# Altium project FreidoraAireCuki.PrjPCB
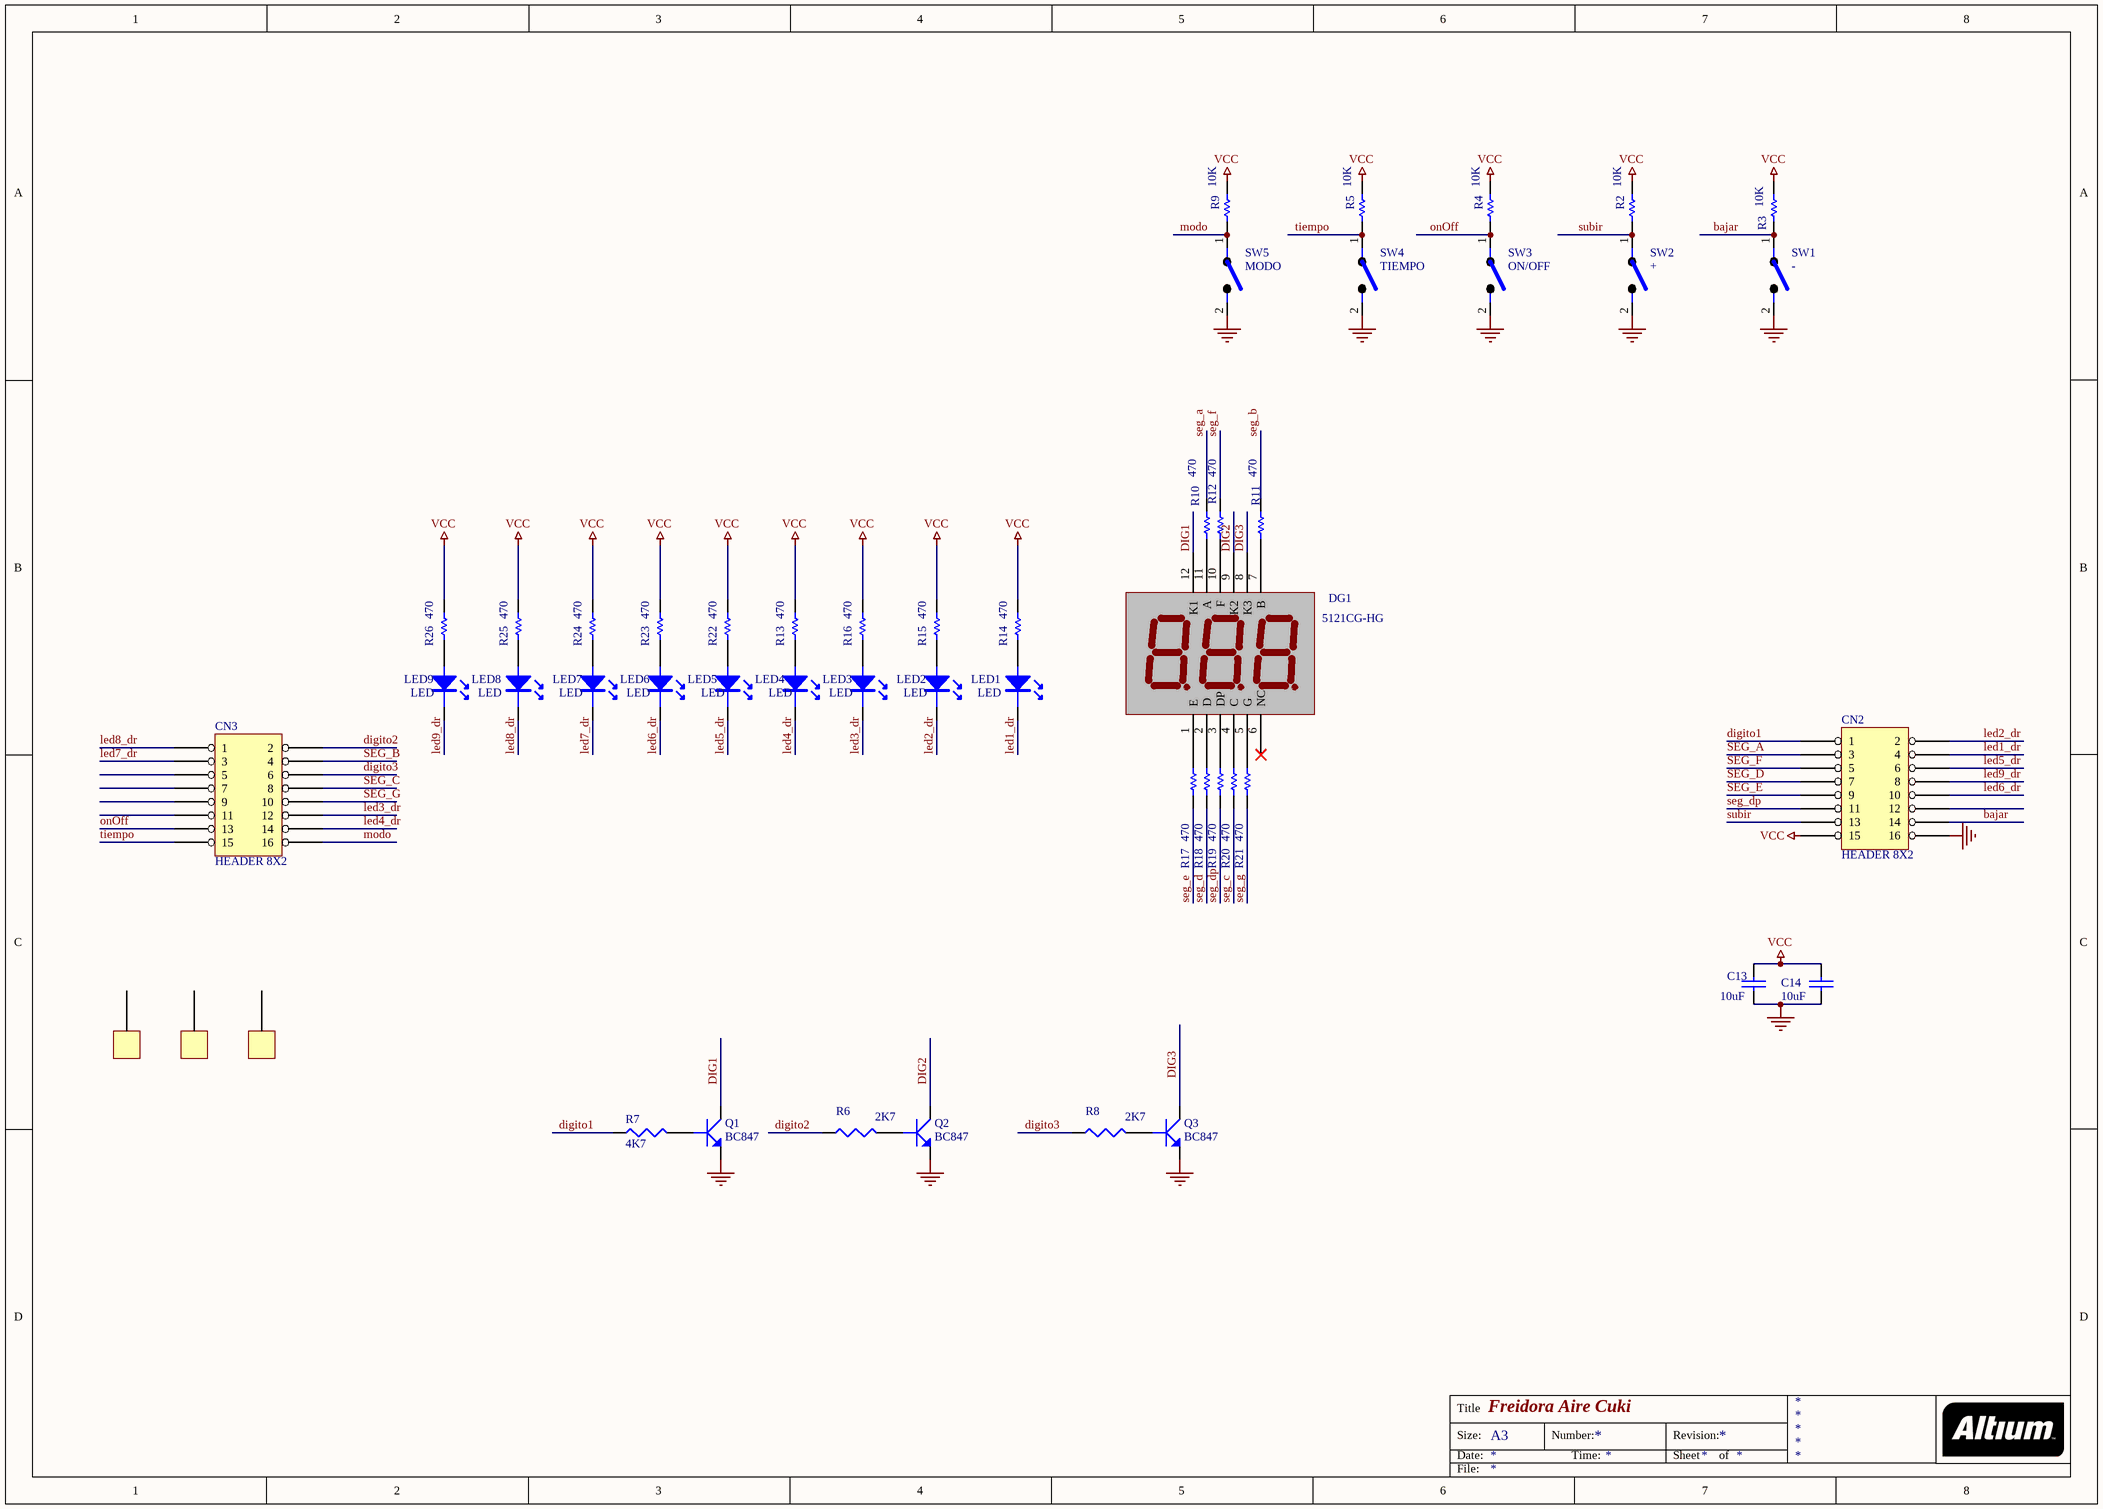
[diagram p0: FreidoraAireCukiDigLeds.SchDoc]
2 sheets, 115 parts. Net scope: global (net labels, ports and power ports of the same name join across sheets).
Board files: FreidoraAireCuki_Mechanical.PcbDoc, FreidoraAireCukiMicro.PcbDoc, FreidoraAireCukiDigLeds.PcbDoc, FreidoraAireCuki_Panel.PcbDoc, FreidoraAireCukiDigLeds_mirrored.PcbDoc, FreidoraAireCukiMicro_mirrored.PcbDoc
Sheets:
  FreidoraAireCukiDigLeds.SchDoc
  FreidoraAireCukiMicro.SchDoc

## Sheet FreidoraAireCukiDigLeds.SchDoc: Freidora Aire Cuki
size A3; Author: Marianito; CompanyName: Marianito INC; DrawnBy: Marianito; Engineer: Marianito; PageSetup: Record=PageOptions|CenterHorizontal=True|CenterVertical=True|PrintScale=0.73|XCorrection=1.00|YCorrection=1.00|PrintKind=0|BorderSize=5000000|LeftOffset=0|BottomOffset=0|Orientation=2|PaperLength=1000|PaperWidth=1000|Scale=100|PaperSource=7|PrintQuality=-4|MediaType=1|DitherType=10|PrintScaleMode=1|PaperKind=A4; ProjectName: Freidora Aire Cuki

### Parts
C13  10uF  [C-0805_N]
C14  10uF  [C-0805_N]
CN2  HEADER 8X2  [SIP2X8]
CN3  HEADER 8X2  [SIP2X8]
DG1  5121CG-HG  [DIGIT_3_400]
LED1  LED  [LED3MM]
LED2  LED  [LED3MM]
LED3  LED  [LED3MM]
LED4  LED  [LED3MM]
LED5  LED  [LED3MM]
LED6  LED  [LED3MM]
LED7  LED  [LED3MM]
LED8  LED  [LED3MM]
LED9  LED  [LED3MM]
Q1  BC847  [SOT23_BOTTOM]
Q2  BC847  [SOT23_BOTTOM]
Q3  BC847  [SOT23_BOTTOM]
R2  10K  [0805BOTTOM]
R3  10K  [0805BOTTOM]
R4  10K  [0805BOTTOM]
R5  10K  [0805BOTTOM]
R6  2K7  [R-0805_N_WAVE]
R7  4K7  [R-0805_N_WAVE]
R8  2K7  [R-0805_N_WAVE]
R9  10K  [0805BOTTOM]
R10  470  [0805BOTTOM]
R11  470  [0805BOTTOM]
R12  470  [0805BOTTOM]
R13  470  [0805BOTTOM]
R14  470  [0805BOTTOM]
R15  470  [0805BOTTOM]
R16  470  [0805BOTTOM]
R17  470  [0805BOTTOM]
R18  470  [0805BOTTOM]
R19  470  [0805BOTTOM]
R20  470  [0805BOTTOM]
R21  470  [0805BOTTOM]
R22  470  [0805BOTTOM]
R23  470  [0805BOTTOM]
R24  470  [0805BOTTOM]
R25  470  [0805BOTTOM]
R26  470  [0805BOTTOM]
SW1  -  [ZIPPY-TS]
SW2  +  [ZIPPY-TS]
SW3  ON/OFF  [ZIPPY-TS]
SW4  TIEMPO  [ZIPPY-TS]
SW5  MODO  [ZIPPY-TS]
TORR1  (no value)  [TORRETA]
TORR2  (no value)  [TORRETA]
TORR3  (no value)  [TORRETA]

### Nets
GND: C13.1 C14.1 CN2.16 Q1.2(E) Q2.2(E) Q3.2(E) SW1.2 SW2.2 SW3.2 SW4.2 SW5.2
VCC: C13.2 C14.2 CN2.15 R2.2 R3.2 R4.2 R5.2 R9.2 R13.2 R14.2 R15.2 R16.2 R22.2 R23.2 R24.2 R25.2 R26.2
bajar: CN2.14 R3.1 SW1.1
DIG1: DG1.12(K1) Q1.3(C)
DIG2: DG1.9(K2) Q2.3(C)
DIG3: DG1.8(K3) Q3.3(C)
digito1: CN2.1 R7.1
digito2: CN3.2 R6.1
digito3: CN3.6 R8.1
led1_dr: CN2.4 LED1.2(K)
led2_dr: CN2.2 LED2.2(K)
led3_dr: CN3.12 LED3.2(K)
led4_dr: CN3.14 LED4.2(K)
led5_dr: CN2.6 LED5.2(K)
led6_dr: CN2.10 LED6.2(K)
led7_dr: CN3.3 LED7.2(K)
led8_dr: CN3.1 LED8.2(K)
led9_dr: CN2.8 LED9.2(K)
modo: CN3.16 R9.1 SW5.1
onOff: CN3.13 R4.1 SW3.1
seg_a: CN2.3 R10.2
seg_b: CN3.4 R11.2
seg_c: CN3.8 R20.1
seg_d: CN2.7 R18.1
seg_dp: CN2.11 R19.1
seg_e: CN2.9 R17.1
seg_f: CN2.5 R12.2
seg_g: CN3.10 R21.1
subir: CN2.13 R2.1 SW2.1
tiempo: CN3.15 R5.1 SW4.1
NetDG1_1: DG1.1(E) R17.2
NetDG1_2: DG1.2(D) R18.2
NetDG1_3: DG1.3(DP) R19.2
NetDG1_4: DG1.4(C) R20.2
NetDG1_5: DG1.5(G) R21.2
NetDG1_7: DG1.7(B) R11.1
NetDG1_10: DG1.10(F) R12.1
NetDG1_11: DG1.11(A) R10.1
NetLED1_1: LED1.1(A) R14.1
NetLED2_1: LED2.1(A) R15.1
NetLED3_1: LED3.1(A) R16.1
NetLED4_1: LED4.1(A) R13.1
NetLED5_1: LED5.1(A) R22.1
NetLED6_1: LED6.1(A) R23.1
NetLED7_1: LED7.1(A) R24.1
NetLED8_1: LED8.1(A) R25.1
NetLED9_1: LED9.1(A) R26.1
NetQ1_1: Q1.1(B) R7.2
NetQ2_1: Q2.1(B) R6.2
NetQ3_1: Q3.1(B) R8.2

Not connected (* = marked no-connect by the designer): CN2 12; CN3 5 7 9 11; DG1 6(NC)*; TORR1 0; TORR2 0; TORR3 0

### Notes on the sheet
- Title
- Size:
- Date:
- A3
- Number:
- Time:
- Revision:
- Sheet
- of
- File:

### Library data of the parts
C13 C14 = CAP: Non polarized capacitor; Value: 100nF; Price: 0,022
CN2 CN3 = HEADER 8X2: HEADER DE 2 X8
DG1 = DIGITO x 3 400: Dígito 0.52' cátodo común verde
LED1-LED9 = LED: Text Field1: 0,04
Q1-Q3 = BC847: NPN transistor bipolar
R2-R5 R9-R26 = RES1: Resistor; Value: 1K; Published: 8-Jun-2000; LatestRevisionDate: 17-Jul-2002; LatestRevisionNote: Re-released for DXP Platform.; PackageReference: AXIAL-0.3; Publisher: Altium Limited; PackageDescription: Axial Device, Thru-Hole; 2 Leads; 0.3 in Pin Spacing
R6-R8 = RES: Resistor; Text Field1: 0,012
SW1-SW5 = TECLA
TORR1-TORR3 = TORRETA

## Sheet FreidoraAireCukiMicro.SchDoc: Freidora Aire Cuki
size A3; Author: Marianito; CompanyName: Marianito INC; DrawnBy: Marianito; Engineer: Marianito; PageSetup: Record=PageOptions|CenterHorizontal=True|CenterVertical=True|PrintScale=0.73|XCorrection=1.00|YCorrection=1.00|PrintKind=0|BorderSize=5000000|LeftOffset=0|BottomOffset=0|Orientation=2|PaperLength=1000|PaperWidth=1000|Scale=100|PaperSource=7|PrintQuality=-4|MediaType=1|DitherType=10|PrintScaleMode=1|PaperKind=A4; ProjectName: Freidora Aire Cuki
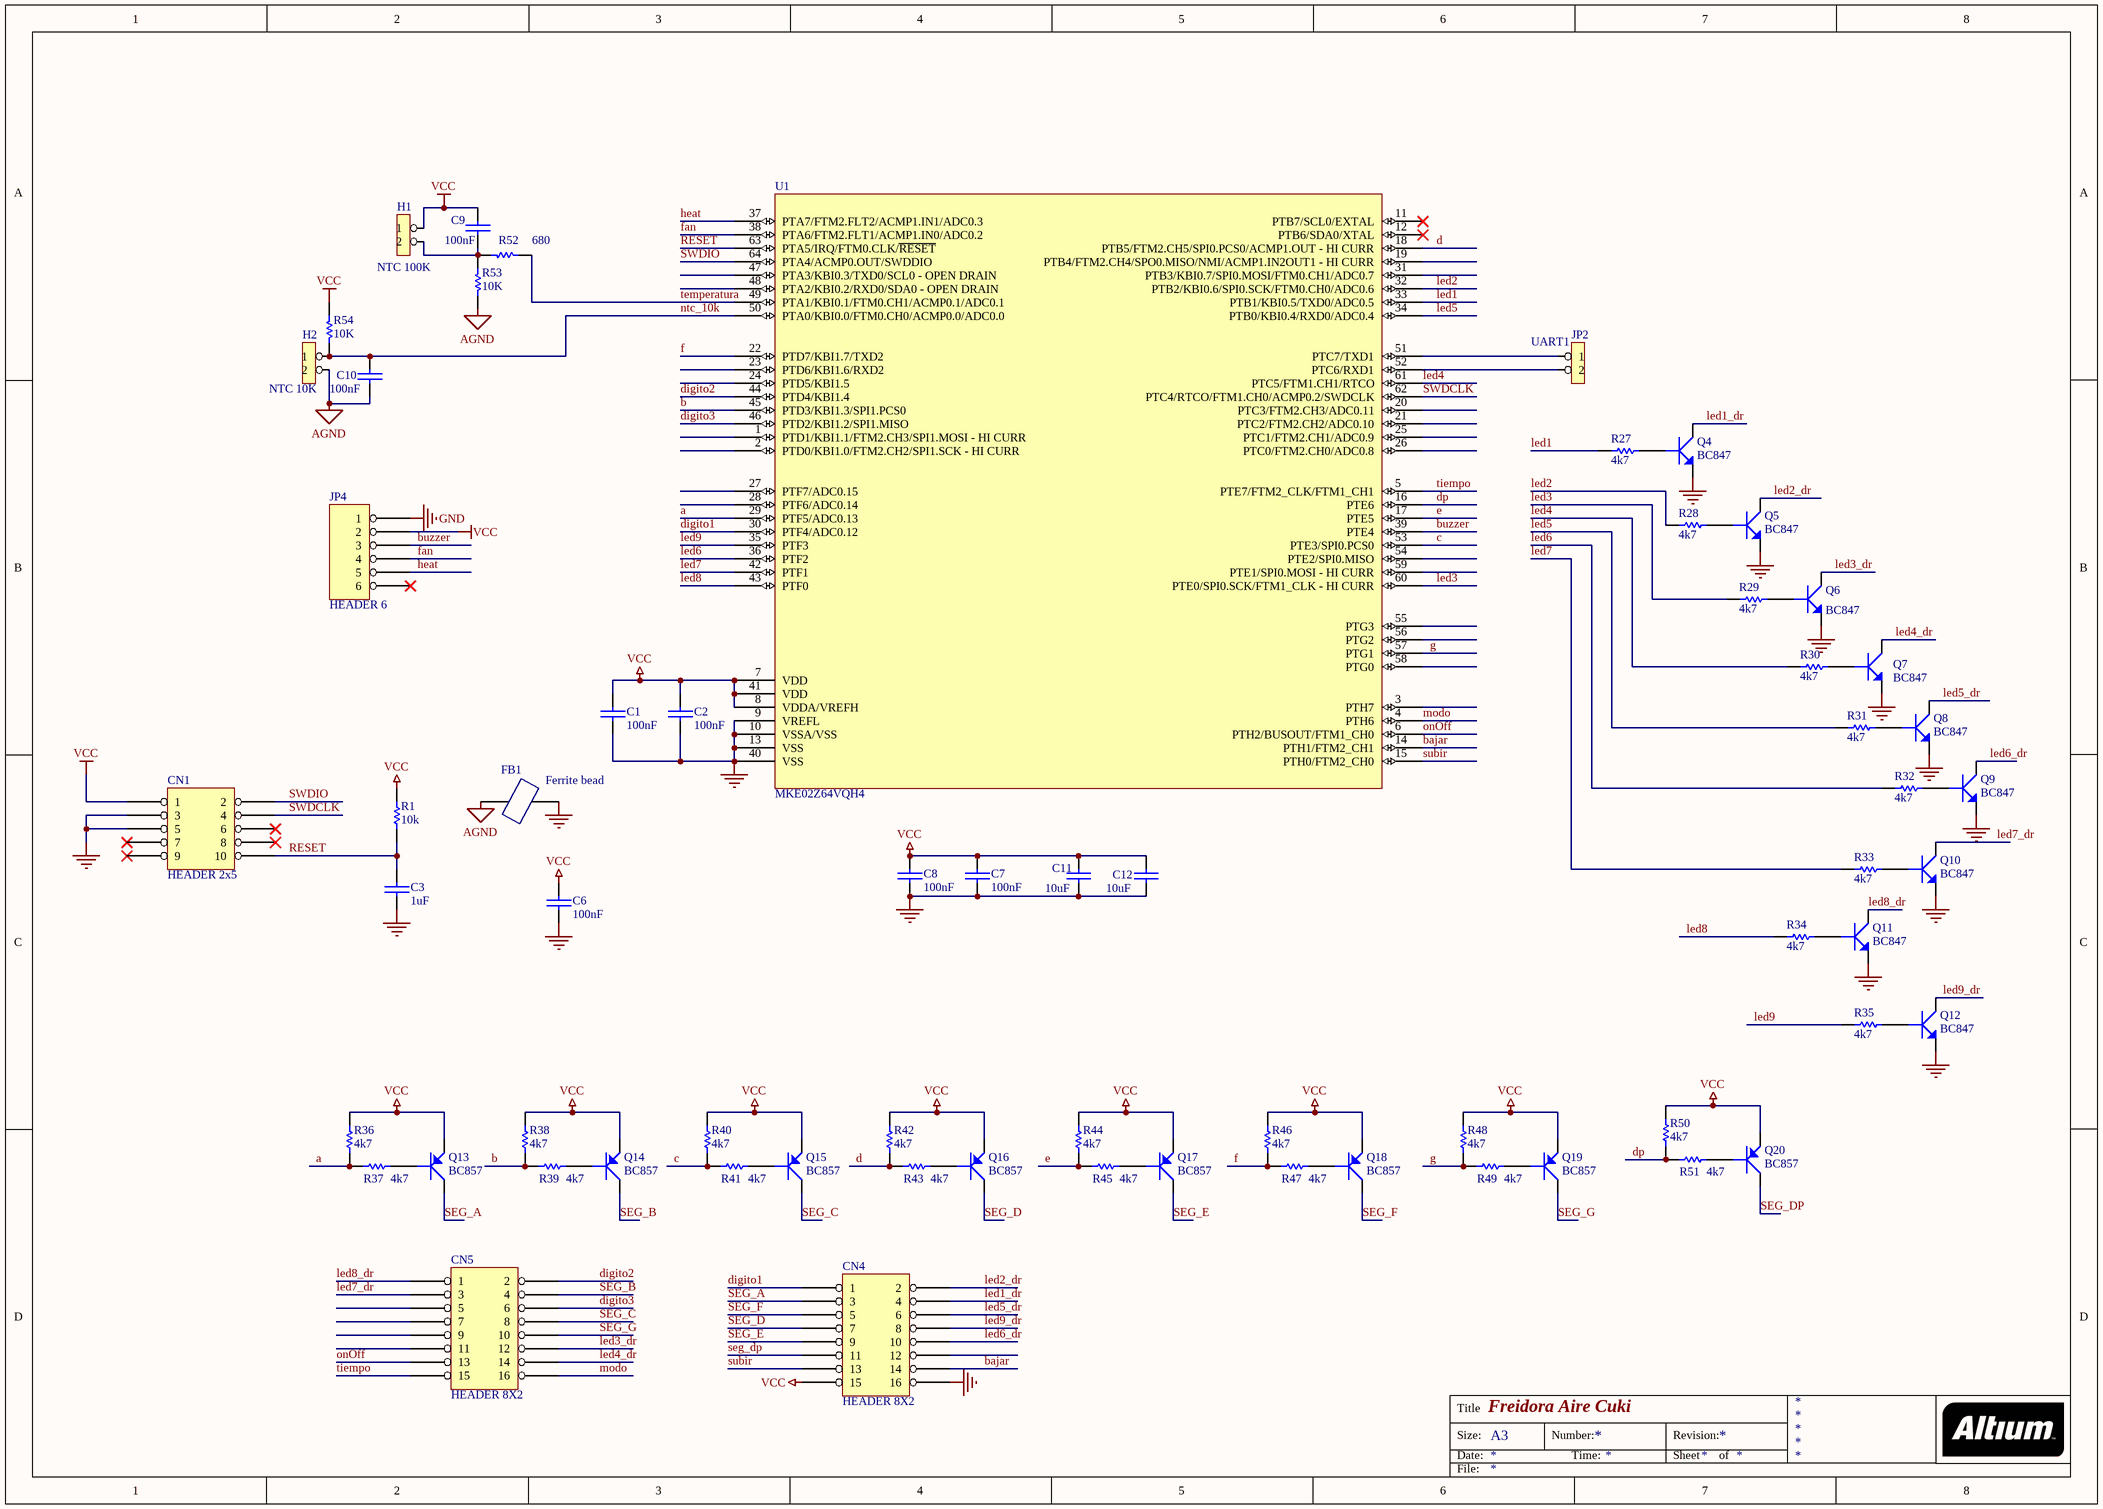
[diagram p1: FreidoraAireCukiMicro.SchDoc]

### Parts
C1  100nF  [C-0805_N]
C2  100nF  [C-0805_N]
C3  1uF  [C-0805_N]
C6  100nF  [C-0805_N]
C7  100nF  [C-0805_N]
C8  100nF  [C-0805_N]
C9  100nF  [C-0805_N]
C10  100nF  [C-0805_N]
C11  10uF  [C-0805_N]
C12  10uF  [C-0805_N]
CN1  HEADER 2x5  [SIP2X5]
CN4  HEADER 8X2  [SIP2X8]
CN5  HEADER 8X2  [SIP2X8]
FB1  Ferrite bead  [C-0805_N]
H1  NTC 100K  [SIP2]
H2  NTC 10K  [SIP2]
JP2  UART1  [SIP2]
JP4  HEADER 6  [SIP6]
Q4  BC847  [SOT23_N]
Q5  BC847  [SOT23_N]
Q6  BC847  [SOT23_N]
Q7  BC847  [SOT23_N]
Q8  BC847  [SOT23_N]
Q9  BC847  [SOT23_N]
Q10  BC847  [SOT23_N]
Q11  BC847  [SOT23_N]
Q12  BC847  [SOT23_N]
Q13  BC857  [SOT23_N]
Q14  BC857  [SOT23_N]
Q15  BC857  [SOT23_N]
Q16  BC857  [SOT23_N]
Q17  BC857  [SOT23_N]
Q18  BC857  [SOT23_N]
Q19  BC857  [SOT23_N]
Q20  BC857  [SOT23_N]
R1  10k  [R-0805_N_WAVE]
R27  4k7  [R-0805_N_WAVE]
R28  4k7  [R-0805_N_WAVE]
R29  4k7  [R-0805_N_WAVE]
R30  4k7  [R-0805_N_WAVE]
R31  4k7  [R-0805_N_WAVE]
R32  4k7  [R-0805_N_WAVE]
R33  4k7  [R-0805_N_WAVE]
R34  4k7  [R-0805_N_WAVE]
R35  4k7  [R-0805_N_WAVE]
R36  4k7  [R-0805_N]
R37  4k7  [R-0805_N]
R38  4k7  [R-0805_N]
R39  4k7  [R-0805_N]
R40  4k7  [R-0805_N]
R41  4k7  [R-0805_N]
R42  4k7  [R-0805_N]
R43  4k7  [R-0805_N]
R44  4k7  [R-0805_N]
R45  4k7  [R-0805_N]
R46  4k7  [R-0805_N]
R47  4k7  [R-0805_N]
R48  4k7  [R-0805_N]
R49  4k7  [R-0805_N]
R50  4k7  [R-0805_N]
R51  4k7  [R-0805_N]
R52  680  [R-0805_N]
R53  10K  [R-0805_N]
R54  10K  [R-0805_N]
U1  MKE02Z64VQH4  [QFP64]

### Nets
AGND: C10.1 FB1.2 H2.2 R53.1
GND: C1.2 C2.2 C3.2 C6.2 C7.2 C8.2 C11.1 C12.1 CN1.3 CN1.5 CN4.16 FB1.1 JP4.1 Q4.2(E) Q5.2(E) Q6.2(E) Q7.2(E) Q8.2(E) Q9.2(E) Q10.2(E) Q11.2(E) Q12.2(E) U1.9(VREFL) U1.10(VSSA/VSS) U1.13(VSS) U1.40(VSS)
VCC: C1.1 C2.1 C6.1 C7.1 C8.1 C9.2 C11.2 C12.2 CN1.1 CN4.15 H1.1 JP4.2 Q13.2(E) Q14.2(E) Q15.2(E) Q16.2(E) Q17.2(E) Q18.2(E) Q19.2(E) Q20.2(E) R1.2 R36.2 R38.2 R40.2 R42.2 R44.2 R46.2 R48.2 R50.2 R54.2 U1.7(VDD) U1.8(VDDA/VREFH) U1.41(VDD)
a: R36.1 R37.1 U1.29(PTF5/ADC0.13)
b: R38.1 R39.1 U1.45(PTD3/KBI1.3/SPI1.PCS0)
bajar: CN4.14 U1.14(PTH1/FTM2_CH1)
buzzer: JP4.3 U1.39(PTE4)
c: R40.1 R41.1 U1.53(PTE3/SPI0.PCS0)
d: R42.1 R43.1 U1.18(PTB5/FTM2.CH5/SPI0.PCS0/ACMP1.OUT_-_HI_CURR)
digito1: CN4.1 U1.30(PTF4/ADC0.12)
digito2: CN5.2 U1.44(PTD4/KBI1.4)
digito3: CN5.6 U1.46(PTD2/KBI1.2/SPI1.MISO)
dp: R50.1 R51.1 U1.16(PTE6)
e: R44.1 R45.1 U1.17(PTE5)
f: R46.1 R47.1 U1.22(PTD7/KBI1.7/TXD2)
fan: JP4.4 U1.38(PTA6/FTM2.FLT1/ACMP1.IN0/ADC0.2)
g: R48.1 R49.1 U1.57(PTG1)
heat: JP4.5 U1.37(PTA7/FTM2.FLT2/ACMP1.IN1/ADC0.3)
led1: R27.2 U1.33(PTB1/KBI0.5/TXD0/ADC0.5)
led1_dr: CN4.4 Q4.3(C)
led2: R28.2 U1.32(PTB2/KBI0.6/SPI0.SCK/FTM0.CH0/ADC0.6)
led2_dr: CN4.2 Q5.3(C)
led3: R29.2 U1.60(PTE0/SPI0.SCK/FTM1_CLK_-_HI_CURR)
led3_dr: CN5.12 Q6.3(C)
led4: R30.2 U1.61(PTC5/FTM1.CH1/RTCO)
led4_dr: CN5.14 Q7.3(C)
led5: R31.2 U1.34(PTB0/KBI0.4/RXD0/ADC0.4)
led5_dr: CN4.6 Q8.3(C)
led6: R32.2 U1.36(PTF2)
led6_dr: CN4.10 Q9.3(C)
led7: R33.2 U1.42(PTF1)
led7_dr: CN5.3 Q10.3(C)
led8: R34.2 U1.43(PTF0)
led8_dr: CN5.1 Q11.3(C)
led9: R35.2 U1.35(PTF3)
led9_dr: CN4.8 Q12.3(C)
modo: CN5.16 U1.4(PTH6)
ntc_10k: C10.2 H2.1 R54.1 U1.50(PTA0/KBI0.0/FTM0.CH0/ACMP0.0/ADC0.0)
onOff: CN5.13 U1.6(PTH2/BUSOUT/FTM1_CH0)
RESET: C3.1 CN1.10 R1.1 U1.63(PTA5/IRQ/FTM0.CLK/~{RESET})
seg_a: CN4.3 Q13.3(C)
seg_b: CN5.4 Q14.3(C)
seg_c: CN5.8 Q15.3(C)
seg_d: CN4.7 Q16.3(C)
seg_dp: CN4.11 Q20.3(C)
seg_e: CN4.9 Q17.3(C)
seg_f: CN4.5 Q18.3(C)
seg_g: CN5.10 Q19.3(C)
subir: CN4.13 U1.15(PTH0/FTM2_CH0)
SWDCLK: CN1.4 U1.62(PTC4/RTCO/FTM1.CH0/ACMP0.2/SWDCLK)
SWDIO: CN1.2 U1.64(PTA4/ACMP0.OUT/SWDDIO)
temperatura: R52.2 U1.49(PTA1/KBI0.1/FTM0.CH1/ACMP0.1/ADC0.1)
tiempo: CN5.15 U1.5(PTE7/FTM2_CLK/FTM1_CH1)
NetC9_1: C9.1 H1.2 R52.1 R53.2
NetJP2_1: JP2.1 U1.51(PTC7/TXD1)
NetJP2_2: JP2.2 U1.52(PTC6/RXD1)
NetQ4_1: Q4.1(B) R27.1
NetQ5_1: Q5.1(B) R28.1
NetQ6_1: Q6.1(B) R29.1
NetQ7_1: Q7.1(B) R30.1
NetQ8_1: Q8.1(B) R31.1
NetQ9_1: Q9.1(B) R32.1
NetQ10_1: Q10.1(B) R33.1
NetQ11_1: Q11.1(B) R34.1
NetQ12_1: Q12.1(B) R35.1
NetQ13_1: Q13.1(B) R37.2
NetQ14_1: Q14.1(B) R39.2
NetQ15_1: Q15.1(B) R41.2
NetQ16_1: Q16.1(B) R43.2
NetQ17_1: Q17.1(B) R45.2
NetQ18_1: Q18.1(B) R47.2
NetQ19_1: Q19.1(B) R49.2
NetQ20_1: Q20.1(B) R51.2

Not connected (* = marked no-connect by the designer): CN1 6* 7* 8* 9*; CN4 12; CN5 5 7 9 11; JP4 6*; U1 1(PTD1/KBI1.1/FTM2.CH3/SPI1.MOSI_-_HI_CURR) 2(PTD0/KBI1.0/FTM2.CH2/SPI1.SCK_-_HI_CURR) 3(PTH7) 11(PTB7/SCL0/EXTAL)* 12(PTB6/SDA0/XTAL)* 19(PTB4/FTM2.CH4/SPO0.MISO/NMI/ACMP1.IN2OUT1_-_HI_CURR) 20(PTC3/FTM2.CH3/ADC0.11) 21(PTC2/FTM2.CH2/ADC0.10) 23(PTD6/KBI1.6/RXD2) 24(PTD5/KBI1.5) 25(PTC1/FTM2.CH1/ADC0.9) 26(PTC0/FTM2.CH0/ADC0.8) 27(PTF7/ADC0.15) 28(PTF6/ADC0.14) 31(PTB3/KBI0.7/SPI0.MOSI/FTM0.CH1/ADC0.7) 47(PTA3/KBI0.3/TXD0/SCL0_-_OPEN_DRAIN) 48(PTA2/KBI0.2/RXD0/SDA0_-_OPEN_DRAIN) 54(PTE2/SPI0.MISO) 55(PTG3) 56(PTG2) 58(PTG0) 59(PTE1/SPI0.MOSI_-_HI_CURR)

### Notes on the sheet
- Title
- Size:
- Date:
- A3
- Number:
- Time:
- Revision:
- Sheet
- of
- File:

### Library data of the parts
C1 C2 C6-C10 = CAP: Non polarized capacitor; Value: 100nF
  C1 C2 C6 C8-C10: Price: 0,022
C3 C11 C12 = CAP: Non polarized capacitor; Value: 100nF
  C11 C12: Price: 0,022
CN1 = HEADER 5X2
CN4 CN5 = HEADER 8X2: HEADER DE 2 X8
H1 H2 JP2 = HEADER 2: Text Field1: 0,006
Q4-Q12 = BC847: NPN transistor bipolar
Q13-Q20 = BC857: PNP bipolar transistor; Price: 0,035
R1 R27-R54 = Res SMD 0805: Resistor SMD 0805; Precio Deksor: 0.00; Value: 1k; Published: 8-Jun-2000; LatestRevisionDate: 17-Jul-2002; LatestRevisionNote: Re-released for DXP Platform.; PackageReference: AXIAL-0.3; Publisher: Altium Limited; PackageDescription: Axial Device, Thru-Hole; 2 Leads; 0.3 in Pin Spacing
  R36-R54: Price: 0,011
U1 = MKE02Z64VQH4: IC MCU 32BIT 64KB FLASH 64QFP; Manufacturer: Freescale Semiconductor; Core Processor: ARM® Cortex®-M0+; Core Size: 32-Bit; Speed: 40MHz; Connectivity: I²C, SPI, UART/USART; Peripherals: LVD, WDT; Number of I/O: 57; Program Memory Size: 64KB (64K x 8); EEPROM Size: 256 x 8; RAM Size: 4K x 8; Voltage - Supply (Vcc/Vdd): 2.7 V ~ 5.5 V; Data Converters: A/D 16x12b, D/A 2x6b; Oscillator Type: Internal; Supplier 1: Digi-Key; Manufacturer Part Number: MKE02Z64VQH4; RoHS: RoHS Compliant; Category: Integrated Circuits (ICs); Stock 1: 60; Packaging: Tray; Program Memory Type: FLASH; Operating Temperature: -40°C ~ 105°C; Package / Case: 64-QFP; Supplier Device Package: 64-QFP (14x14); ComponentLink1URL: http://cache.freescale.com/files/microcontrollers/doc/data_sheet/MKE02P64M40SF0.pdf; ComponentLink1Description: http://cache.freescale.com/files/microcontrollers/doc/data_sheet/MKE02P64M40SF0.pdf

## Nets that join several sheets
GND: FreidoraAireCukiDigLeds (11 pins), FreidoraAireCukiMicro (26 pins)
VCC: FreidoraAireCukiDigLeds (17 pins), FreidoraAireCukiMicro (33 pins)
bajar: FreidoraAireCukiDigLeds (CN2.14 R3.1 SW1.1), FreidoraAireCukiMicro (CN4.14 U1.14)
digito1: FreidoraAireCukiDigLeds (CN2.1 R7.1), FreidoraAireCukiMicro (CN4.1 U1.30)
digito2: FreidoraAireCukiDigLeds (CN3.2 R6.1), FreidoraAireCukiMicro (CN5.2 U1.44)
digito3: FreidoraAireCukiDigLeds (CN3.6 R8.1), FreidoraAireCukiMicro (CN5.6 U1.46)
led1_dr: FreidoraAireCukiDigLeds (CN2.4 LED1.2), FreidoraAireCukiMicro (CN4.4 Q4.3)
led2_dr: FreidoraAireCukiDigLeds (CN2.2 LED2.2), FreidoraAireCukiMicro (CN4.2 Q5.3)
led3_dr: FreidoraAireCukiDigLeds (CN3.12 LED3.2), FreidoraAireCukiMicro (CN5.12 Q6.3)
led4_dr: FreidoraAireCukiDigLeds (CN3.14 LED4.2), FreidoraAireCukiMicro (CN5.14 Q7.3)
led5_dr: FreidoraAireCukiDigLeds (CN2.6 LED5.2), FreidoraAireCukiMicro (CN4.6 Q8.3)
led6_dr: FreidoraAireCukiDigLeds (CN2.10 LED6.2), FreidoraAireCukiMicro (CN4.10 Q9.3)
led7_dr: FreidoraAireCukiDigLeds (CN3.3 LED7.2), FreidoraAireCukiMicro (CN5.3 Q10.3)
led8_dr: FreidoraAireCukiDigLeds (CN3.1 LED8.2), FreidoraAireCukiMicro (CN5.1 Q11.3)
led9_dr: FreidoraAireCukiDigLeds (CN2.8 LED9.2), FreidoraAireCukiMicro (CN4.8 Q12.3)
modo: FreidoraAireCukiDigLeds (CN3.16 R9.1 SW5.1), FreidoraAireCukiMicro (CN5.16 U1.4)
onOff: FreidoraAireCukiDigLeds (CN3.13 R4.1 SW3.1), FreidoraAireCukiMicro (CN5.13 U1.6)
seg_a: FreidoraAireCukiDigLeds (CN2.3 R10.2), FreidoraAireCukiMicro (CN4.3 Q13.3)
seg_b: FreidoraAireCukiDigLeds (CN3.4 R11.2), FreidoraAireCukiMicro (CN5.4 Q14.3)
seg_c: FreidoraAireCukiDigLeds (CN3.8 R20.1), FreidoraAireCukiMicro (CN5.8 Q15.3)
seg_d: FreidoraAireCukiDigLeds (CN2.7 R18.1), FreidoraAireCukiMicro (CN4.7 Q16.3)
seg_dp: FreidoraAireCukiDigLeds (CN2.11 R19.1), FreidoraAireCukiMicro (CN4.11 Q20.3)
seg_e: FreidoraAireCukiDigLeds (CN2.9 R17.1), FreidoraAireCukiMicro (CN4.9 Q17.3)
seg_f: FreidoraAireCukiDigLeds (CN2.5 R12.2), FreidoraAireCukiMicro (CN4.5 Q18.3)
seg_g: FreidoraAireCukiDigLeds (CN3.10 R21.1), FreidoraAireCukiMicro (CN5.10 Q19.3)
subir: FreidoraAireCukiDigLeds (CN2.13 R2.1 SW2.1), FreidoraAireCukiMicro (CN4.13 U1.15)
tiempo: FreidoraAireCukiDigLeds (CN3.15 R5.1 SW4.1), FreidoraAireCukiMicro (CN5.15 U1.5)